# EAGLE design femtoduinoUSB (EAGLE 6.2)
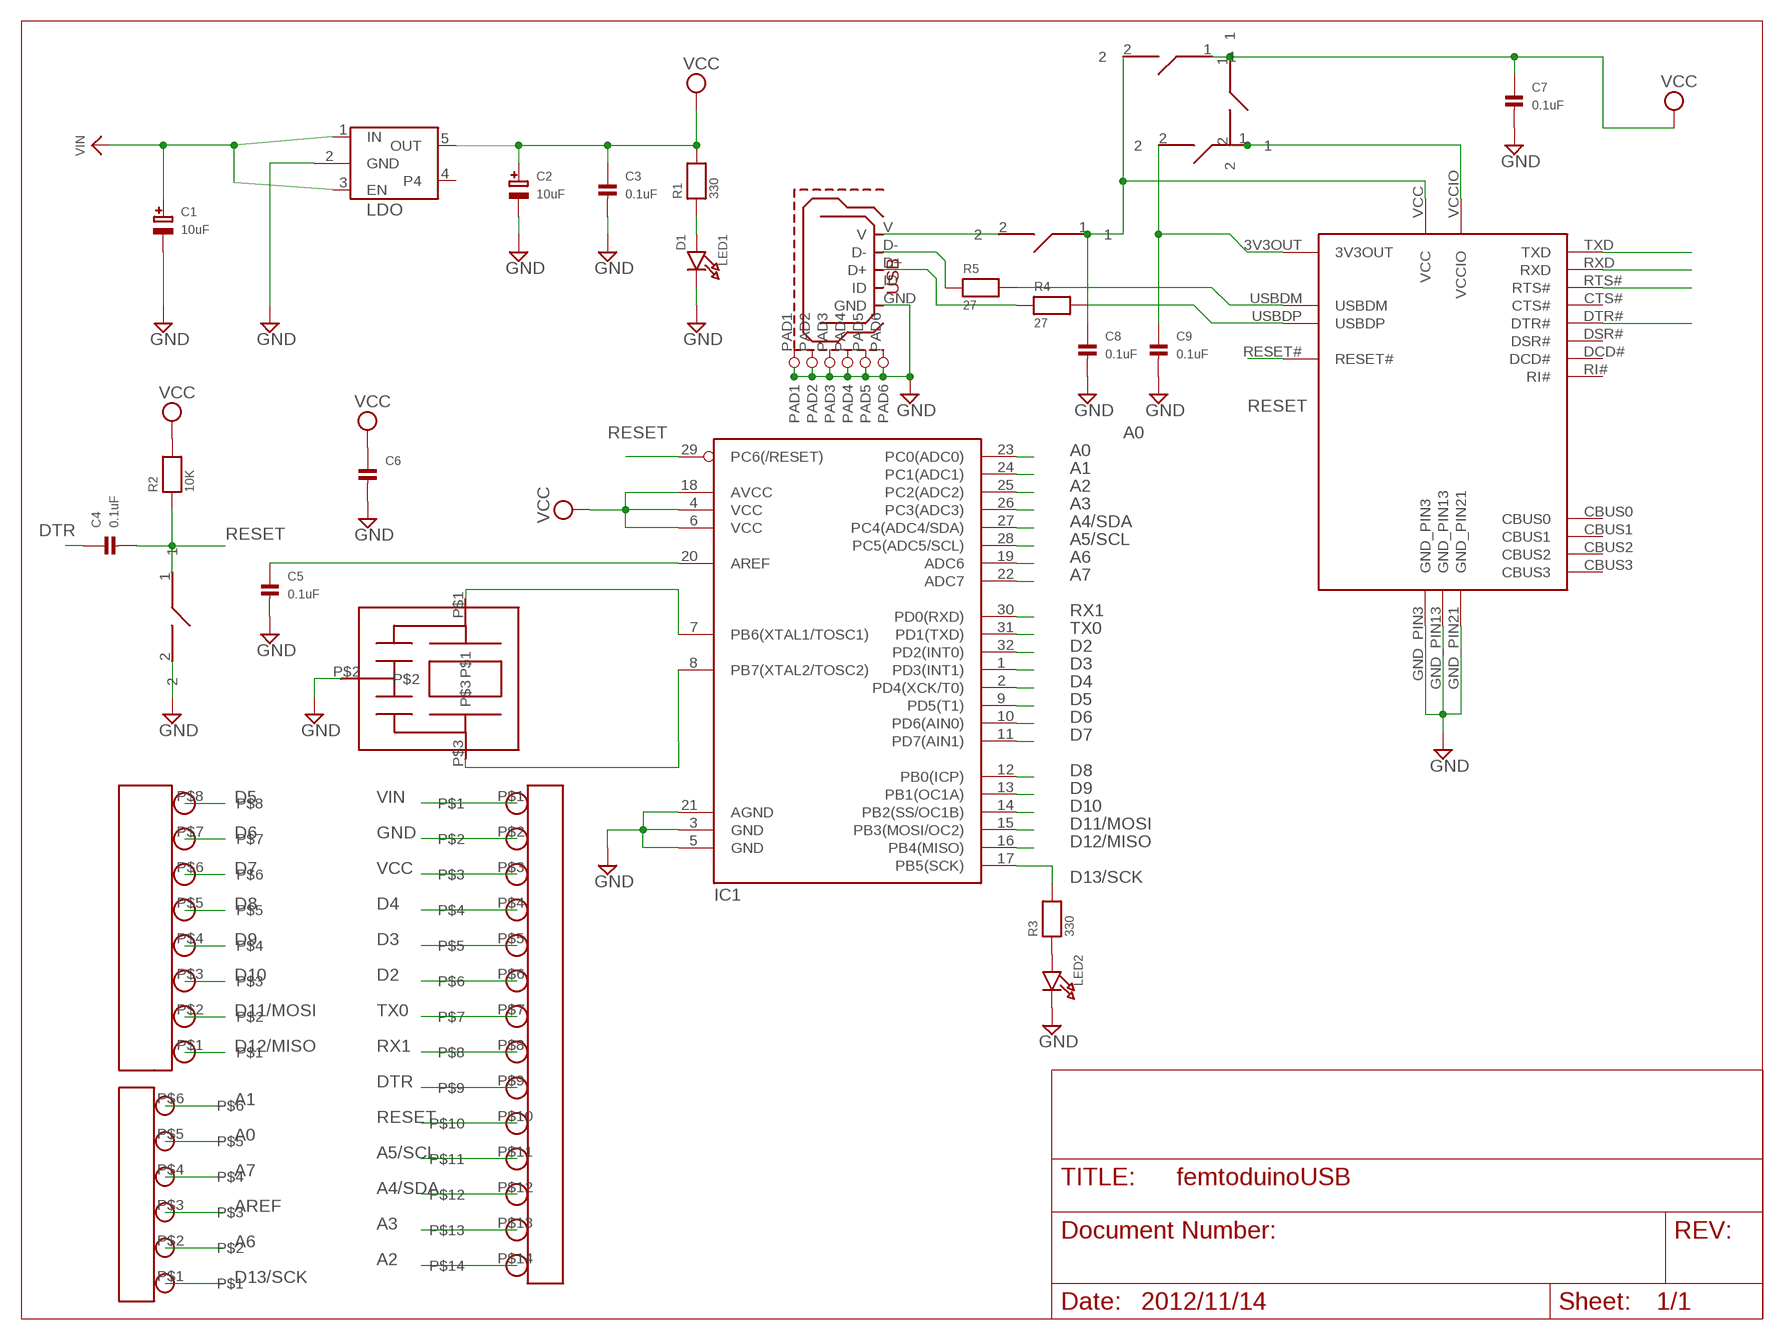
[diagram p0: schematic, sheet 1]
FRAME1 (LETTER_L): LAST_DATE_TIME: 2012/11/14

## Parts
C1  10uF  CAP_TANTALUMB/3528_WAVE  [EIA3528-21/B-W]
C2  10uF  CAP_TANTALUMB/3528_WAVE  [EIA3528-21/B-W]
C3  0.1uF  CAP_CERAMIC0402  [0402]
C4  0.1uF  CAP_CERAMIC0402  [0402]
C5  0.1uF  CAP_CERAMIC0402  [0402]
C6  CAP_CERAMIC0402  [0402]
C7  0.1uF  CAP_CERAMIC0402  [0402]
C8  0.1uF  CAP_CERAMIC0402  [0402]
C9  0.1uF  CAP_CERAMIC0402  [0402]
IC1  ATMEGA168MLF  [MLF32]
IC2  FT231XQ-R  [FTDI_FT231XQ-R_PACKAGE]
LED1  D1  LED0805  [CHIPLED_0805]
LED2  LED0805  [CHIPLED_0805]
R1  330  RESISTOR0402  [0402]
R2  10K  RESISTOR0402  [0402]
R3  330  RESISTOR0402  [0402]
R4  27  RESISTOR0402  [0402]
R5  27  RESISTOR0402  [0402]
SJ1  SPST_SMD  [SPST_SMD]
SJ2  SPST_SMD  [SPST_SMD]
SJ3  SPST_SMD  [SPST_SMD]
SJ4  SPST_SMD  [SPST_SMD]
U1  MIC5205  LDO_REGULATOR  [LDO_REGULATOR]
U$2  05_PINHEAD_1X6  [05_PINHEAD_1X6_PACKAGE]
U$3  05_PINHEAD_1X8  [05_PINHEAD_1X8_PACKAGE]
U$4  05_PINHEAD_1X14  [05_PINHEAD_1X14_PACKAGE]
U$5  CSTCE16MOV51-RO  [CSTCE16M0V51-RO_PACKAGE]
U$6  SPST_SMD  [SPST_SMD]
USB1  USB_MICROB  [USB_MICROB_PACKAGE]

## Nets
A0: IC1.23(PC0(ADC0)) U$2.P$5
A1: IC1.24(PC1(ADC1)) U$2.P$6
A2: IC1.25(PC2(ADC2)) U$4.P$14
A3: IC1.26(PC3(ADC3)) U$4.P$13
A4/SDA: IC1.27(PC4(ADC4/SDA)) U$4.P$12
A5/SCL: IC1.28(PC5(ADC5/SCL)) U$4.P$11
A6: IC1.19(ADC6) U$2.P$2
A7: IC1.22(ADC7) U$2.P$4
AREF: C5.1 IC1.20(AREF) U$2.P$3
D2: IC1.32(PD2(INT0)) U$4.P$6
D3: IC1.1(PD3(INT1)) U$4.P$5
D4: IC1.2(PD4(XCK/T0)) U$4.P$4
D5: IC1.9(PD5(T1)) U$3.P$8
D6: IC1.10(PD6(AIN0)) U$3.P$7
D7: IC1.11(PD7(AIN1)) U$3.P$6
D8: IC1.12(PB0(ICP)) U$3.P$5
D9: IC1.13(PB1(OC1A)) U$3.P$4
D10: IC1.14(PB2(SS/OC1B)) U$3.P$3
D11/MOSI: IC1.15(PB3(MOSI/OC2)) U$3.P$2
D12/MISO: IC1.16(PB4(MISO)) U$3.P$1
D13/SCK: IC1.17(PB5(SCK)) R3.2 U$2.P$1
DTR: C4.1 U$4.P$9
GND: C1.- C2.- C3.2 C5.2 C6.2 C7.2 C8.2 C9.2 IC1.3(GND) IC1.5(GND) IC1.21(AGND) IC2.GND_PIN3 IC2.GND_PIN13 IC2.GND_PIN21 LED1.C LED2.C U1.2(GND) U$4.P$2 U$5.P$2 U$6.2 USB1.GND
N$1: R4.1 USB1.D+
N$2: R5.1 USB1.D-
N$3: IC2.RTS#
N$4: C8.1 IC2.VCC SJ1.1 SJ2.2
N$5: LED1.A R1.1
N$6: IC2.USBDM R5.2
N$7: IC2.USBDP R4.2
N$8: C9.1 IC2.3V3OUT SJ4.2
N$9: IC2.VCCIO SJ3.2 SJ4.1
N$25: LED2.A R3.1
PB6: IC1.7(PB6(XTAL1/TOSC1)) U$5.P$1
PB7: IC1.8(PB7(XTAL2/TOSC2)) U$5.P$3
RESET: C4.2 IC1.29(PC6(/RESET)) IC2.DTR# IC2.RESET# R2.1 U$4.P$10 U$6.1
RX1: IC1.30(PD0(RXD)) IC2.TXD U$4.P$8
TX0: IC1.31(PD1(TXD)) IC2.RXD U$4.P$7
VCC: C2.+ C3.1 C6.1 C7.1 IC1.4(VCC) IC1.6(VCC) IC1.18(AVCC) R1.2 R2.2 SJ1.2 SJ2.1 SJ3.1 U1.5(OUT) U$4.P$3 USB1.V
VIN: C1.+ U1.1(IN) U1.3(EN) U$4.P$1
Unconnected: IC2.CBUS0 IC2.CBUS1 IC2.CBUS2 IC2.CBUS3 IC2.CTS# IC2.DCD# IC2.DSR# IC2.RI# U1.4 USB1.ID USB1.PAD1 USB1.PAD2 USB1.PAD3 USB1.PAD4 USB1.PAD5 USB1.PAD6

## Library data of the parts
C1 C2 = microbuilder:CAP_TANTALUM: Tantalum Capacitors Wave footprints have larger pads and are meant to be used for hand soldering. Reflow footprints are optimised for solder paste and a reflow oven. EIA3216-18/A-[R/W] - Size A / 3216-18 / 1206 footprint 4.7µF 25V 10% Tantalum Capacitor 10µF 16V 10% Tantalum Capacitor [Digikey: 495-2236-2-ND] EIA3528-21/B-[R/W] - Size B / 3528-21 47µF 10V 10% Tantalum Capactior [Digikey: 495-2216-1-ND] EIA6032-28/C-[R/W] - Size C / 6032-28 10µF 35V 20% Tantalum Capacitor [Digikey: 495-2285-1-ND] 100µF 16V 10% Tantalum Capactior [Digikey: 399-5214-1-ND]
C3-C9 = microbuilder:CAP_CERAMIC: Ceramic Capacitors 0402 - 0402 Surface Mount Capacitors 16pF 50V 5% [Digikey: 445-4899-2-ND] 18pF 50V 5% [Digikey: 490-1281-2-ND] 22pF 50V 5% [Digikey: 490-1283-2-ND] 68pF 50V 5% [Digikey: 490-1289-2-ND] 0.1uF 10V 10% [Digikey: 490-1318-2-ND] 1.0uF 6.3V 10% [Digikey: 490-1320-2-ND] 0603 - 0603 Surface Mount Capacitors 16 pF 50V 5% [Digikey: 445-5051-2-ND] 22 pF 50V [Digikey: PCC220ACVTR-ND] 33 pF 50V 5% [Digikey: 490-1415-1-ND] 56pF 50V 5% [Digikey: 490-1421-1-ND] 220pF 50V 5% [Digikey: 445-1285-1-ND] 680 pF 50V 2200 pF 50V 5% C0G [Digikey: 445-1297-1-ND] 5600 pF 100V 5% X7R [Digikey: 478-3711-1-ND] 0.1 µF 25V 10% [Digikey: PCC2277TR-ND] 0.22 µF 16V 10% X7R [Digikey: 445-1318-1-ND] 1.0 µF 25V 10% [Digikey: 445-5146-2-ND] 0603 - RF Specific 3pF 250V +/-0.1pF RF [Digikey: 712-1347-1-ND] 18 pF 250V 5% [Digikey: 478-3505-1-ND or 712-1322-1-ND] 56 pF 250V 5% C0G RF [Digikey: 490-4867-1-ND] 68 pF 250V RF [Digikey: 490-4868-1-ND] 0805 - 0805 Surface Mount Capacitors 220 pF 250V 2% RF Ceramic Capacitor [Digikey: 712-1398-1-ND] 1000 pF 50V 2% NP0 Ceramic Capacitor [Digikey: 478-3760-1-ND] 0.1 µF 25V 10% Ceramic Capacitor [Digikey: PCC1828TR-ND] 1.0 µF 16V 10% Ceramic Capacitor[Digikey: 490-1691-2-ND] 10.0 µF 10V 10% Ceramic Capacitor[Digikey: 709-1228-1-ND] 10.0 uF 16V 10% Ceramic Capacitor [Digikey: 478-5165-2-ND] 47 uF 6.3V 20% Ceramic Capacitor [Digikey: 587-1779-1-ND or 399-5506-1-ND] 1206 - 1206 Surface Mount Capacitors 47uF 10V 20% Ceramic Capacitor [Digikey: 490-5528-1-ND or 399-5508-1-ND or 445-6010-1-ND] 100uF 6.3V -20%, +80% Y5V Ceramic Capacitor (Digikey: 490-4512-1-ND, Mouser: 81-GRM31CF50J107ZE1L)
IC1 = SparkFun-DigitalIC:ATMEGA168: Atmel 32-pin 8-bit micro, 16k flash.
IC2 = ftdi_ft231xq-r:FT231XQ-R: This is the 20-LD QFN package of the FTDI FT231XQ-R chip.
LED1 LED2 = microbuilder:LED: LED 0603 - 0603 Surface Mount Package 2mA: Green LED - Low Power (3.9mcd, 2ma, 1.7Vf) - Digikey: 475-2709-2-ND Orange LED - Low Power (9.8mcd, 2ma, 1.8Vf) - Digikey: 475-1194-2-ND Red LED - Low Power (5mcd, 2ma, 1.8Vf) - Digikey: 475-1195-2-ND Yellow LED - Low Power (7mcd, 2ma, 1.8Vf) - Digikey: 475-1196-2-ND 5mA: Blue LED - Low Power (17mcd, 5ma, 2.9Vf) - Digikey: LNJ937W8CRACT-ND 0805 - 0805 Surface Mount Package 2mA: Red LED (8.8mcd, 2mA, 1.8Vf, Clear) - Low Power [Digikey: 475-2510-1-ND] Green LED (5mcd, 2mA, 1.8Vf, Clear) - Low Power [Digikey: 475-2730-1-ND] Yellow LED (11.3mcd, 2mA, 1.8Vf, Clear) - Low Power [Digikey: 475-2555-1-ND] 20mA: Red LED (104mcd, 20mA, Diffused) - LS R976 [Digikey: 475-1278-6-ND] Red LED (12mcd, 20mA, 2.0Vf, Clear) - APT2012EC [Digikey: 754-1128-1-ND] Green LED (15mcd, 20mA, 2.2Vf, Clear) - APT2012GC [Digikey: 754-1131-1-ND] Orange LED (160mcd, 20mA, 2.1Vf, Clear) - APT2012SECK [Digikey: 754-1130-1-ND] 1206 - 1206 Surface Mount Package Green LED (26mcd, 20mA, Diffused) - LG N971 [Digikey: 475-1407-6-ND] Red LED (15mcd, 20mA, Diffused) - LH N974 [Digikey: 475-1416-6-ND]
R1-R5 = microbuilder:RESISTOR: Resistors 0402 - 0402 Surface Mount Package 22 Ohm 1% 1/16W [Digikey: 311-22.0LRTR-ND] 33 Ohm 5% 1/16W 1.0K 5% 1/16W 1.5K 5% 1/16W 2.0K 1% 1/16W 10.0K 1% 1/16W [Digikey: 311-10.0KLRTR-ND] 10.0K 5% 1/16W [Digikey: RMCF0402JT10K0TR-ND] 12.1K 1% 1/16W [Digikey: 311-22.0LRTR-ND] 100.0K 5% 1/16W 0603 - 0603 Surface Mount Package 0 Ohm 1/10 Watt 1% Resistor 15 Ohm 1/10 Watt 1% Resistor 33 Ohm 1/10 Watt 1% Resistor 49.9 Ohm 1/10 Watt 1% Resistor 100 Ohm 1/10 Watt 1% Resistor 150 Ohm 1/10 Watt 1% Resistor 240 Ohm 1/10 Watt 1% Resistor 390 Ohm 1/10 Watt 1% Resistor 560 Ohm 1/10 Watt 1% Resistor 680 Ohm 1/10 Watt 1% Resistor 750 Ohm 1/10 Watt 1% Resistor 1.0K Ohm 1/10 Watt 1% Resistor 1.5K Ohm 1/10 Watt 1% Resistor 2.0K Ohm 1/10 Watt 1% Resistor 2.2K Ohm 1/10 Watt 1% Resistor 3.3K Ohm 1/10 Watt 1% Resistor 4.7K Ohm 1/10 Watt 1% Resistor 10.0K Ohm 1/10 Watt 1% Resistor 12.0K Ohm 1/10 Watt 1% Resistor 12.1K Ohm 1/10 Watt 1% Resistor 20.0K Ohm 1/10 Watt 1% Resistor 33.0K Ohm 1/10 Watt 1% Resistor 100.0K Ohm 1/10 Watt 1% Resistor 0805 - 0805 Surface Mount Package 0 Ohm 1/8 Watt 1% Resistor 33 Ohm 1/8 Watt 1% Resistor 100 Ohm 1/8 Watt 1% Resistor 150 Ohm 1/8 Watt 1% Resistor 200 Ohm 1/8 Watt 1% Resistor 240 Ohm 1/8 Watt 1% Resistor 330 Ohm 1/8 Watt 1% Resistor 390 Ohm 1/8 Watt 1% Resistor 470 Ohm 1/8 Watt 1% Resistor 1.0K Ohm 1/8 Watt 1% Resistor 1.5K Ohm 1/8 Watt 1% Resistor 2.0K Ohm 1/8 Watt 1% Resistor 4.7K Ohm 1/8 Watt 1% Resistor 5.1K Ohm 1/8 Watt 1% Resistor 5.6K Ohm 1/8 Watt 1% Resistor 10.0K Ohm 1/8 Watt 1% Resistor 22.0K Ohm 1/8 Watt 1% Resistor 33.0K Ohm 1/8 Watt 1% Resistor 100K Ohm 1/8 Watt 1% Resistor 1206 - 1206 Surface Mount Package 2012 - 2010 Surface Mount Package 0.11 Ohm 1/2 Watt 1% Resistor - Digikey: RHM.11UCT-ND
SJ1-SJ4 U$6 = ftdi_ft231xq-r:SPST_SMD
U1 = ftdi_ft231xq-r:LDO_REGULATOR
U$2 = ftdi_ft231xq-r:05_PINHEAD_1X6
U$3 = ftdi_ft231xq-r:05_PINHEAD_1X8
U$4 = ftdi_ft231xq-r:05_PINHEAD_1X14
U$5 = ftdi_ft231xq-r:CSTCE16MOV51-RO: This is the CSTCE16M0V51-R0 Murata resonator (CERALOCK) 16Mhz 0.5% Tolerance
USB1 = ftdi_ft231xq-r:USB_MICROB: This is the hirose ZX62-B-5PA(11) MICRO-USB B Type female connection.

## Board
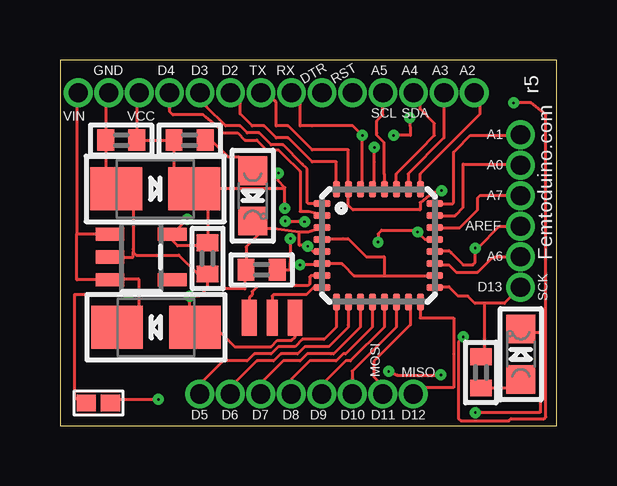
[diagram p1: board, top side]
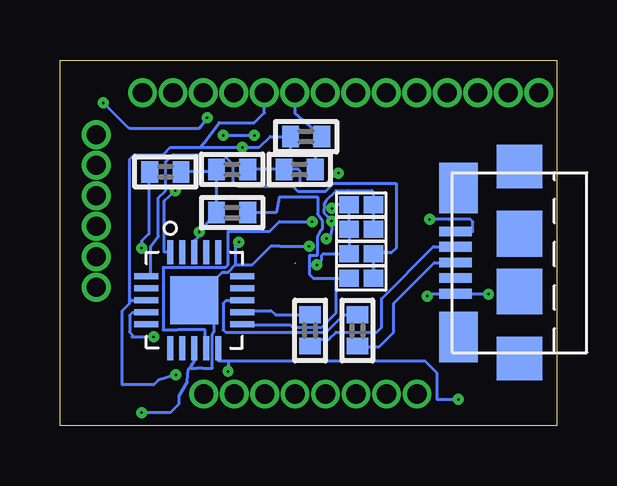
[diagram p2: board, bottom side, seen from below]

Size 20.7 x 15.24 mm. Coordinates in mm from the lower left corner, seen from the top.
Outline: 0,0 20.7,0 20.7,15.24 0,15.24 0,0
Copper layers (1*16): Top 0.0356mm / dielectric 1.5011mm / Bottom 0.0356mm
Design rules: minimum track width 6mil, minimum drill 13mil, track to track 6mil, track to pad 6mil, pad to pad 6mil, via to via 6mil, smd to smd 6mil, copper to edge 15mil, drill to drill 6mil, minimum pad ring 7mil, minimum via ring 7mil, stop-mask expansion 4mil, vias tented up to drill 0mil, thermal gap 10mil

### Footprints (pad centres in the part's own frame; a part is rotated, then mirrored left to right if it is on the bottom)
EIA3528-21/B-W = smd 2.15 x 1.8: + 1.625,0; - -1.625,0
0402 = smd 0.7 x 0.9: 1 -0.65,0; 2 0.65,0
MLF32 = smd 0.7 x 0.3: 1 -2.35,1.75; 2 -2.35,1.25; 3 -2.35,0.75; 4 -2.35,0.25; 5 -2.35,-0.25; 6 -2.35,-0.75; 7 -2.35,-1.25; 8 -2.35,-1.75; 17 2.35,-1.75; 18 2.35,-1.25; 19 2.35,-0.75; 20 2.35,-0.25; 21 2.35,0.25; 22 2.35,0.75; 23 2.35,1.25; 24 2.35,1.75 | smd 0.3 x 0.7: 9 -1.75,-2.35; 10 -1.25,-2.35; 11 -0.75,-2.35; 12 -0.25,-2.35; 13 0.25,-2.35; 14 0.75,-2.35; 15 1.25,-2.35; 16 1.75,-2.35; 25 1.75,2.35; 26 1.25,2.35; 27 0.75,2.35; 28 0.25,2.35; 29 -0.25,2.35; 30 -0.75,2.35; 31 -1.25,2.35; 32 -1.75,2.35
FTDI_FT231XQ-R_PACKAGE = smd 0.25 x 1: 3V3OUT -1.032,-2.032; CBUS2 0.468,-2.032; CBUS3 -1.032,1.968; CTS# 0.968,-2.032; DTR# -0.032,1.968; RTS# 0.468,1.968; TXD -0.532,1.968; USBDM -0.532,-2.032; USBDP -0.032,-2.032; VCCIO 0.968,1.968 | smd 1 x 0.25: CBUS0 -2.032,0.968; CBUS1 -2.032,0.468; DCD# 1.968,-1.032; DSR# 1.968,-0.532; GND_PIN3 1.968,-0.032; GND_PIN13 -2.032,-0.032; RESET# -2.032,-1.032; RI# 1.968,0.468; RXD 1.968,0.968; VCC -2.032,-0.532 | smd 2 x 2: GND_PIN21 -0.032,-0.032
CHIPLED_0805 = smd 1.2 x 1.2: A 0,-1.05; C 0,1.05
SPST_SMD = smd 0.8 x 0.699: 1 -0.508,0; 2 0.508,0
LDO_REGULATOR = smd 0.55 x 1.2: 1 -0.95,-1.3; 2 0,-1.3; 3 0.95,-1.3; 4 0.95,1.3; 5 -0.95,1.3
05_PINHEAD_1X6_PACKAGE = drill 0.8 pad 1.143: P$1 0,0; P$2 0,1.27; P$3 0,2.54; P$4 0,3.81; P$5 0,5.08; P$6 0,6.35
05_PINHEAD_1X8_PACKAGE = drill 0.8 pad 1.143: P$1 0,0; P$2 0,1.27; P$3 0,2.54; P$4 0,3.81; P$5 0,5.08; P$6 0,6.35; P$7 0,7.62; P$8 0,8.89
05_PINHEAD_1X14_PACKAGE = drill 0.8 pad 1.143: P$1 0,0; P$2 0,1.27; P$3 0,2.54; P$4 0,3.81; P$5 0,5.08; P$6 0,6.35; P$7 0,7.62; P$8 0,8.89; P$9 0,10.16; P$10 0,11.43; P$11 0,12.7; P$12 0,13.97; P$13 0,15.24; P$14 0,16.51
CSTCE16M0V51-RO_PACKAGE = smd 1.5 x 0.62: P$1 0,1.9; P$2 0,0 | smd 1.5 x 0.45: P$3 0,0.95
USB_MICROB_PACKAGE = smd 0.4 x 1.35: D+ 0,-0.68; D- 0.66,-0.68; GND -1.3,-0.68; ID -0.64,-0.68; V 1.3,-0.68 | smd 2.1 x 1.6: PAD1 -3.1,-0.8; PAD2 3.1,-0.8 | smd 1.8 x 1.9: PAD3 -4,-3.35; PAD6 4,-3.35 | smd 1.9 x 1.9: PAD4 -1.2,-3.35; PAD5 1.2,-3.35

### Placement (x,y rotation side)
C1  4,4.1 180 top
C2  3.97,9.87 0 top
C3  2.55,11.9 180 top
C4  10.45,12.05 180 bottom
C5  16.31,10.58 0 bottom
C6  6.15,6.97 270 top
C7  13.53,10.68 180 bottom
C8  8.4,6.5 180 top
C9  13.53,8.88 180 bottom
IC1  13.27,7.51 0 top
IC2  15.13,5.27 90 bottom
LED1  8.03,9.58 180 top
LED2  19.2,2.98 0 top
R1  5.4,11.9 180 top
R2  10.72,10.68 180 bottom
R3  17.54,2.22 90 top
R4  8.31,3.97 90 bottom
R5  10.28,3.97 90 bottom
SJ1  8.15,9.21 180 bottom
SJ2  8.15,8.19 0 bottom
SJ3  8.15,7.17 0 bottom
SJ4  8.15,6.15 180 bottom
U1  3.38,7.03 270 top
U$2  19.19,5.77 0 top
U$3  14.72,1.32 90 top
U$4  0.76,13.87 270 top
U$5  9.79,4.5 90 top
U$6  1.6,0.95 180 top
USB1  4.9,6.8 90 bottom

### Tracks (layer width: path | path; a pad name or v marks a point on that pad's centre or on a via)
A0
  Top 0.127: IC1.23 16.46,8.76 16.5,8.8 16.8,9.1 16.8,10.9 19.14,10.9 U$2.P$5
A1
  Top 0.127: IC1.24 16.36,9.26 16.4,9.3 16.4,11.4 16.5,11.5 17.1,12.1 19.17,12.1 U$2.P$6
A2
  Top 0.127: IC1.25 15.02,10.48 15,10.5 17.5,13 17.5,13.85 U$4.P$14
A3
  Top 0.127: U$4.P$13 16,12 14.5,10.5 14.5,9.88 IC1.26
A4/SDA
  Top 0.127: IC1.27 14.02,10.48 14,10.5 15,11.5 15.6,12.1 15.6,12.6 15,13.2 15,13.6 U$4.P$12
A5/SCL
  Top 0.127: IC1.28 13.5,9.88 13.5,10.5 13.5,11.8 13.2,12.1 13.2,12.2 13.2,12.7 13.46,12.96 U$4.P$11
A6
  Top 0.127: IC1.19 15.68,6.7 16.2,6.7 16.5,6.4 17.4,6.4 18,7 18.1,7 18.14,7.04 U$2.P$2
A7
  Top 0.127: IC1.22 16.66,8.26 16.7,8.3 17.4,9 17.4,9.5 17.5,9.6 19.17,9.6 U$2.P$4
AREF  (via drill 0.1 pad 0.12)
  Top 0.127: IC1.20 15.7,7.3 16.2,7.3 16.3,7.2 16.8,6.7 17.2,6.7 17.3,6.8 v17.3,7.4 17.4,7.4 18.31,8.31 U$2.P$3
  Bottom 0.127: C5.1 17,10.5 17,8 17.3,7.7 v17.3,7.4
D2
  Top 0.127: IC1.32 11.52,10.98 11.5,11 10.5,11 9.5,12 9,12 8.5,12.5 8,12.5 7.5,13 7.5,13.73 U$4.P$6
D3
  Top 0.127: IC1.1 10.34,9.26 10.3,9.3 10.3,10.7 10.1,10.9 9.3,11.7 8.8,11.7 8.3,12.2 7.8,12.2 7.5,12.5 6.9,12.5 6.1,13.3 6.1,13.86 U$4.P$5
D4
  Top 0.127: IC1.2 10.88,8.8 10.38,8.93 10,8.93 10,10.6 9.3,11.3 9.1,11.5 8.6,11.5 8.2,11.9 7.7,11.9 7.4,12.2 6.8,12.2 6.5,12.5 6.04,12.88 5.97,12.95 4.7,12.95 4.57,13.09 U$4.P$4
D5
  Top 0.127: IC1.9 11.5,5.14 11.5,4.1 11,3.6 10.1,3.6 9.8,3.3 9.1,3.3 8.8,3 8.1,3 7.8,2.7 6.8,2.7 5.83,1.73 U$3.P$8
D6
  Top 0.127: IC1.10 12,5.14 12,4.2 12,4.1 11.2,3.3 10.2,3.3 9.9,3 9.2,3 8.9,2.7 8.2,2.7 7.1,1.6 U$3.P$7
D7
  Top 0.127: IC1.11 12.5,5.14 12.5,4.1 11.4,3 11.3,3 10.3,3 10,2.7 9.3,2.7 8.37,1.77 U$3.P$6
D8
  Top 0.127: IC1.12 13,5.14 13,4.1 11.9,3 11.8,3 11.5,2.7 10.4,2.7 9.64,1.94 U$3.P$5
D9
  Top 0.127: IC1.13 13.5,5.14 13.5,4.1 12.1,2.7 11.9,2.7 10.91,1.71 U$3.P$4
D10
  Top 0.127: IC1.14 14,5.14 14,4.1 12.18,2.28 12.18,1.88 U$3.P$3
D11/MOSI
  Top 0.127: IC1.15 14.6,5.08 14.6,4.2 13.08,2.68 13.08,2.03 13.45,1.67 U$3.P$2
D12/MISO
  Top 0.127: IC1.16 15,5.14 15,4.5 16.4,4.5 16.4,3 16.4,1.59 15.05,1.59 14.72,1.52 U$3.P$1
D13/SCK
  Top 0.127: IC1.17 15.66,5.8 16.2,5.8 16.6,5.4 16.99,5.4 17.29,5.1 17.7,5.1 | U$2.P$1 18.52,5.1 17.7,5.1 | R3.2 17.7,3.03 17.7,5.1
DTR
  Bottom 0.127: U$4.P$9 10.92,13.02 C4.1
GND  (via drill 0.1 pad 0.1, 0.1 pad 0.12)
  Top 0.127: U$4.P$2 1.9,13.49 C3.2 1.9,10.2 2.23,9.87 C2.- 3.05,9.87 3.05,7.37 3.05,7.24 | IC1.3 10.35,8.07 9.97,8.07 | 9.97,8.07 8.9,8.2 8.5,8.2 | 8.5,8.2 8.17,8.53 LED1.C | 8.5,8.2 7.75,7.45 C8.2 7.7,6.85 7.7,5.7 6.2,5.7 6.15,5.75 | 6.15,5.75 C6.2 6.1,6.35 5.71,6.35 4.95,7.11 3.17,7.11 3.05,7.24 | IC1.5 10.86,7.2 10.6,7.2 v10.32,7.48 10.29,7.52 9.97,7.52 9.97,8.07 | 19.23,4 LED2.C 19.33,3.9 20,3.9 20,0.55 v17.3,0.55 | 6.15,5.75 5.8,5.4 v5.4,5.4 5.4,4.33 C1.- 6.47,4.1 7.27,3.3 8.8,3.3 9.06,3.56 9.65,3.56 9.79,3.7 U$5.P$2 | U$6.2 0.85,0.95 0.6,1.2 0.6,5.47 v2.85,5.47 v2.85,5.48 | v13.25,7.65 13.25,8 13.4,8.15 14.82,8.15 v14.9,8.07 15.21,7.76 IC1.21 | U1.2 3.05,7.03 3.05,7.24
  Bottom 0.127: v17.3,0.55 16.1,0.55 15.75,0.9 15.75,1.24 15.4,1.84 15.35,2.35 15.3,2.4 | C5.2 14.28,10.58 C7.2 C9.2 14.22,8.88 v14.9,8.07 14.9,7.9 | v2.85,5.48 3.1,5.5 USB1.GND 5.3,5.5 v5.4,5.4 | 13.4,6.7 13.7,6.4 13.85,6.4 13.94,6.4 IC2.GND_PIN21 14.9,5.04 14.3,4.44 14.3,3.9 14.35,3.85 14.35,3.8 14.35,2.4 14.75,2.4 15,2.4 15.3,2.4 | 13.4,6.7 12.7,6.7 12.3,7.1 11.91,7.49 11.56,7.49 11.54,7.48 v10.32,7.48 | 15.05,7.75 15.1,7.7 IC2.GND_PIN3 15.05,7.29 15.05,7.75 | 15.05,7.75 14.9,7.9 | 15.1,3.6 IC2.GND_PIN13 15.1,2.7 15.3,2.4 | 15.05,7.75 14.9,7.9 | v13.25,7.65 13.4,7.5 13.4,6.7
N$1
  Bottom 0.127: R4.1 8.29,3.3 7.4,3.3 6.8,3.9 6.8,5.1 5.1,6.8 USB1.D+
N$2
  Bottom 0.127: R5.1 10,3.6 9.5,3.6 9.2,3.9 9,3.9 7.5,3.9 7.3,4.1 7.3,5.3 5.14,7.46 USB1.D-
N$4  (via drill 0.1 pad 0.12)
  Top 0.127: v9.6,7.8 9.6,6.8 | 9.6,6.8 9.6,6.5 | C8.1 9.6,6.5 | 9.6,6.5 9.6,6.8 | v10.19,8.5 9.41,8.5 v9.39,8.53
  Bottom 0.127: SJ2.2 SJ1.1 7.64,9.74 7.7,9.8 8.7,9.8 9.2,9.8 9.6,9.4 9.69,9.24 9.7,8.88 v9.39,8.53 9.37,8.16 9.44,7.89 v9.6,7.8 | IC2.VCC 14.65,3.29 14.65,4 15.8,4 16.4,4 16.4,6.6 16,6.6 13.8,6.6 13.7,6.7 13.7,8.1 13,8.1 11.97,8.1 11.56,8.51 10.33,8.51 v10.19,8.5
N$5
  Top 0.127: R1.1 6.3,11.9 7,11.2 7.46,11.2 LED1.A
N$6
  Bottom 0.127: IC2.USBDM 13.04,4.8 11.9,4.8 11.72,4.62 11.42,4.62 R5.2
N$7
  Bottom 0.127: IC2.USBDP 13.14,5.2 13.8,5.2 13.9,5.1 13.9,4 13.8,3.9 11.1,3.9 9.6,3.9 8.98,4.52 8.98,4.62 R4.2 8.58,4.62
N$8
  Bottom 0.127: 9.2,6.15 10.15,6.15 10.29,6.29 10.29,7.11 9.97,7.11 9.97,7.87 9.84,8.13 9.78,8.19 9.78,8.57 9.97,8.83 9.97,9.53 11.56,9.53 11.69,8.88 C9.1 | 9.2,6.15 SJ4.2 | 9.2,6.15 9.2,4.7 9.8,4.1 11,4.1 11.1,4.2 13.06,4.2 IC2.3V3OUT
N$9
  Bottom 0.127: SJ4.1 SJ3.2 7.6,7.2 6.9,7.2 6.7,7.4 6.7,10.1 9.3,10.1 9.62,9.78 10.8,9.78 11,9.98 13.3,9.98 13.5,10.18 13.5,10.9 13.9,11.3 16,11.3 16.3,11 16.3,9.8 16.6,9.5 16.6,7.9 16.93,7.47 16.93,6.27 16.8,6.3 IC2.VCCIO
N$25
  Top 0.127: LED2.A 18.84,1.57 R3.1
PB6
  Top 0.127: IC1.7 10.46,6.26 10.4,6.2 10.4,6 10.4,5.9 10.34,5.84 8.26,5.84 8,5.59 8,5.46 7.89,5.35 U$5.P$1
PB7
  Top 0.127: IC1.8 10.56,5.76 10.3,5.5 10.26,5.46 9.02,5.46 8.89,5.46 8.84,5.41 U$5.P$3
RESET  (via drill 0.1 pad 0.12)
  Top 0.127: U$6.1 2.24,1.08 2.26,1.1 v4.1,1.1 | v13.7,2.27 14.05,2.11 v15.87,2.11 v15.87,2.12 | IC1.29 13.1,9.94 13.1,11 v13.1,11.6
  Bottom 0.127: R2.1 10.07,11.27 10.1,11.3 11.1,11.3 11.1,11.4 C4.2 11.95,12.05 12.4,11.6 v13.1,11.6 13.7,11.6 | U$4.P$10 12.19,13.04 12.6,12.63 12.62,12.63 14.07,12.63 14.71,11.77 14.84,11.6 | IC2.RESET# | 14.1,2.7 13.7,2.7 | 13.7,2.7 7.4,2.7 5.5,2.7 5,2.2 5,1.1 v4.1,1.1 | IC2.DTR# 17.14,5.2 17.7,5.2 17.8,5.3 | 17.8,5.3 17.8,7.7 17.8,11.1 17.6,11.3 16.4,11.3 16.1,11.6 14.84,11.6 | 14.84,11.6 13.94,11.6 | 13.94,11.6 13.7,11.6 | 13.94,11.6 13.7,11.6 | IC2.RESET# 14.1,2.7 | IC2.RESET# 14.1,2.7 | 14.1,2.7 13.7,2.7 | 13.7,2.7 v13.7,2.27 | v15.87,2.12 16.6,1.9 16.8,1.7 18.1,1.7 18.1,4.8 17.8,5.1 17.8,5.3
RX1  (via drill 0.1 pad 0.12)
  Top 0.127: U$4.P$8 10,13.77 10,12.5 10.5,12.5 12.2,12.5 v12.6,12.1 12.6,9.98 12.5,9.88 IC1.30 | v16.8,3.7 16.6,3.5 16.6,0.9 16.6,0.3 16.7,0.2 18.7,0.2 18.8,0.3 20.17,0.3 20.25,0.37 20.25,12.97 19.64,13.45 v18.9,13.45 | v14.57,12.84 14.6,12.1 v13.9,12.1
  Bottom 0.127: IC2.TXD 17.14,4.7 17.7,4.7 17.8,4.6 17.8,3.9 17.7,3.8 17.7,3.7 v16.8,3.7 | v14.57,12.84 14.9,12.4 17.8,12.4 17.85,12.4 v18.9,13.45 | v13.9,12.1 v12.6,12.1
TX0  (via drill 0.1 pad 0.12)
  Top 0.127: U$4.P$7 9,13.5 9,12.5 9.5,12.5 10.5,11.5 12,11.5 12.02,11.48 IC1.31 12.02,9.18 12.2,9 15,9 15,9.3 15.5,9.7 v15.9,9.8
  Bottom 0.127: IC2.RXD 16.35,7.24 16.35,9.37 v15.9,9.8
VCC  (via drill 0.1 pad 0.12)  (1 unrouted)
  Top 0.127: U$4.P$3 3.2,13.52 C3.1 R1.2 4.75,10.71 C2.+ | C2.+ 6.15,9.31 C6.1 6.03,7.5 4.9,7.5 4.68,7.72 U1.5 v5.3,8.6 | IC1.6 11.74,6.76 11.8,6.7 12.24,6.26 13.5,6.26 | 13.5,6.26 IC1.18 | 10.9,7.74 IC1.4 10.96,7.8 11.8,7.8 12,7.8 12.75,7.05 13.5,7.05 13.5,6.26 | 10.9,6.8 10.8,6.7 v10,6.7 | v9.37,9.05 9.37,9.93 | 9.37,9.93 9.3,9.87 C2.+ | 9.37,9.93 9.1,10.2 v9.1,10.53 | v5.3,8.6
  Bottom 0.127: C7.1 R2.2 10.78,10.68 10.7,10.6 10.7,10 9.7,10 9.5,10.2 9.3,10.45 v9.1,10.53 | v10,6.7 9.8,6.9 9.8,7.1 9.73,7.17 SJ3.1 SJ2.1 SJ1.2 9.17,9.2 9.23,9.2 v9.37,9.05 | USB1.V 3.5,8.1 3.5,8.5 3.6,8.6 4.5,8.6 v5.3,8.6
VIN
  Top 0.127: U$4.P$1 0.7,13.57 0.7,8 | 2.08,8 U1.1 2.08,8 | 0.7,8 2.08,8 | C1.+ 3.3,4.1 3.3,5.97 3.3,6.1 2.16,6.1 U1.3 0.7,6.08 0.7,8

### Text on the board
tNames: GND | D4 | D3 | D2 | TX | RX | A5 | A4 | A3 | A2 | DTR | RST | r5 | VIN | VCC | SCL | SDA | A1 | A0 | A7 | AREF | A6 | Femtoduino.com | D13 | SCK | MOSI | MISO | D5 | D6 | D7 | D8 | D9 | D10 | D11 | D12